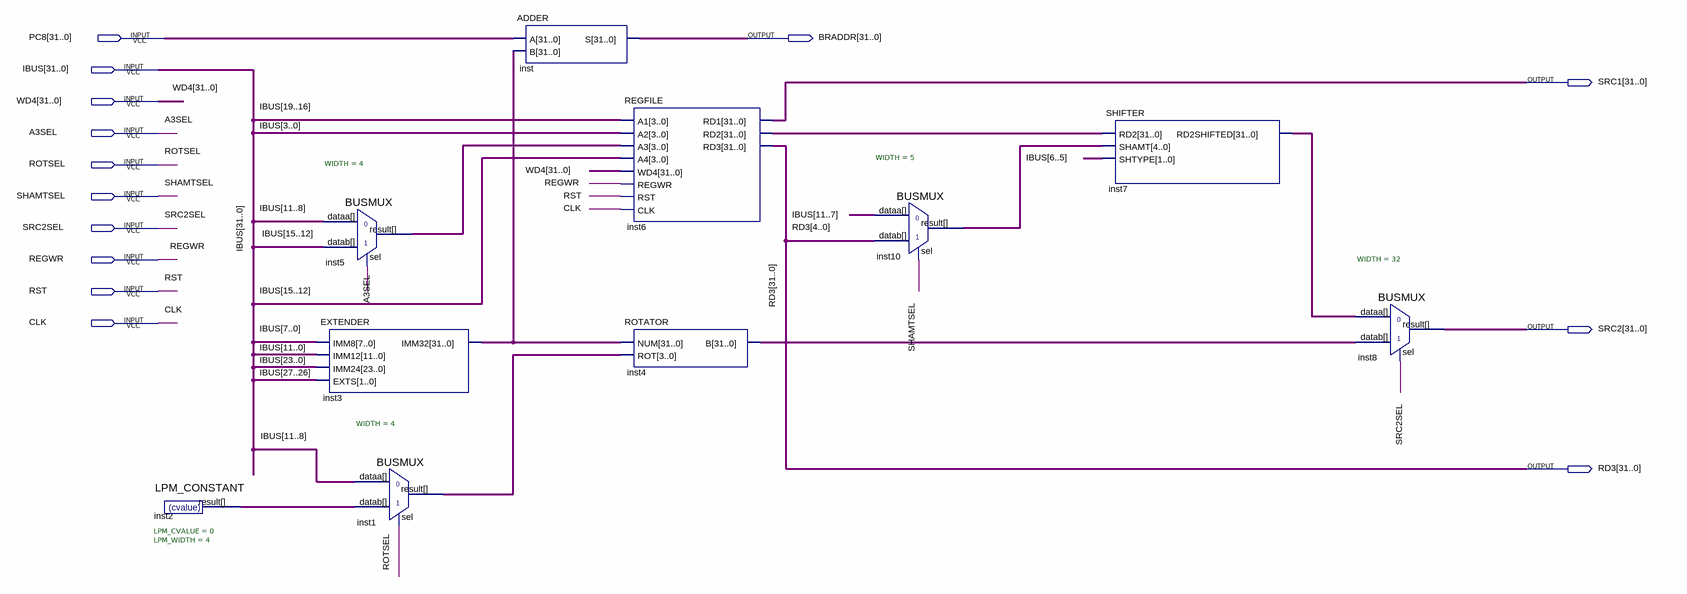
[diagram p0: schematic sheet]
// Quartus schematic decode.bdf as structural Verilog: 10 symbols, 14 pins
module decode (
  input  [31:0] PC8,
  input  [31:0] IBUS,
  input  [31:0] WD4,
  input  A3SEL,
  input  ROTSEL,
  input  SHAMTSEL,
  input  SRC2SEL,
  input  REGWR,
  input  RST,
  input  CLK,
  output [31:0] BRADDR,
  output [31:0] SRC1,
  output [31:0] SRC2,
  output [31:0] RD3
);

  wire [3:0] inst1_result, inst2_result, inst5_result;
  wire [4:0] inst10_result;
  wire [31:0] inst3_imm32, inst4_b, inst6_rd2, inst7_rd2shifted;

  LPM_CONSTANT #(.LPM_CVALUE(0), .LPM_WIDTH(4)) inst2 (.result(inst2_result));
  EXTENDER inst3 (.IMM8(IBUS[7:0]), .IMM12(IBUS[11:0]), .IMM24(IBUS[23:0]), .EXTS(IBUS[27:26]), .IMM32(inst3_imm32));
  BUSMUX #(.WIDTH(4)) inst5 (.datab(IBUS[15:12]), .sel(A3SEL), .dataa(IBUS[11:8]), .result(inst5_result));
  BUSMUX #(.WIDTH(4)) inst1 (.datab(inst2_result), .sel(ROTSEL), .dataa(IBUS[11:8]), .result(inst1_result));
  ADDER inst (.A(PC8), .B(inst3_imm32), .S(BRADDR));
  REGFILE inst6 (
    .A1(IBUS[19:16]), .A2(IBUS[3:0]), .A3(inst5_result), .A4(IBUS[15:12]), .WD4(WD4), .REGWR(REGWR),
    .RST(RST), .CLK(CLK), .RD1(SRC1), .RD2(inst6_rd2), .RD3(RD3));
  ROTATOR inst4 (.NUM(inst3_imm32), .ROT(inst1_result), .B(inst4_b));
  BUSMUX #(.WIDTH(5)) inst10 (.datab(RD3[4:0]), .sel(SHAMTSEL), .dataa(IBUS[11:7]), .result(inst10_result));
  SHIFTER inst7 (.RD2(inst6_rd2), .SHAMT(inst10_result), .SHTYPE(IBUS[6:5]), .RD2SHIFTED(inst7_rd2shifted));
  BUSMUX #(.WIDTH(32)) inst8 (.datab(inst4_b), .sel(SRC2SEL), .dataa(inst7_rd2shifted), .result(SRC2));
endmodule
